# EAGLE design Audio_Cape_B1 (EAGLE 6.5.0)
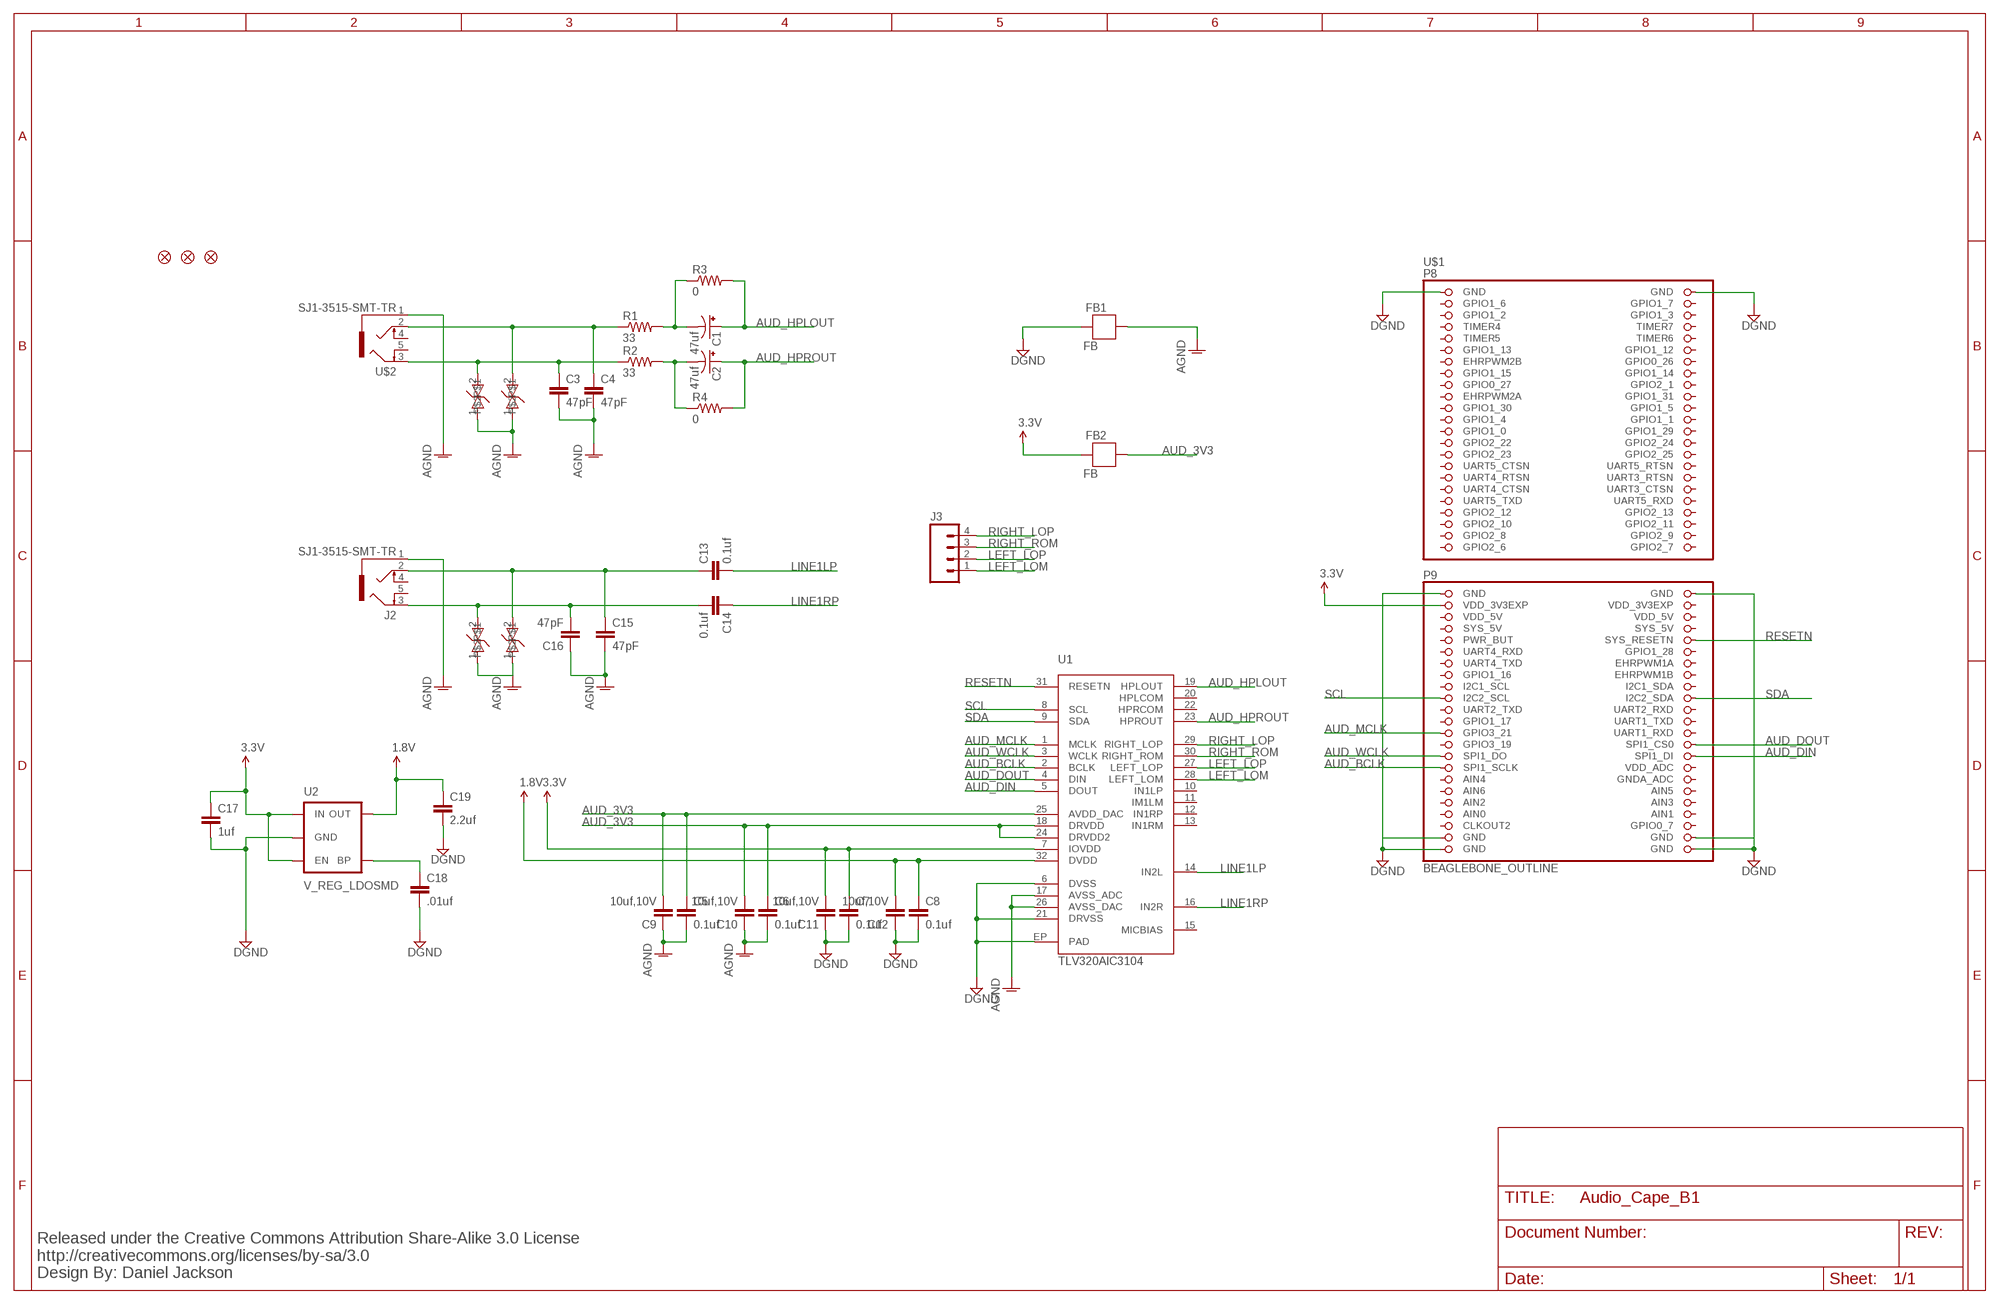
[diagram p0: schematic, sheet 1]

## Parts
C1  47uf  CAP_POL1206  [EIA3216]
C2  47uf  CAP_POL1206  [EIA3216]
C3  47pF  CAP0402-CAP  [0402-CAP]
C4  47pF  CAP0402-CAP  [0402-CAP]
C5  0.1uf  CAP0402-CAP  [0402-CAP]
C6  0.1uf  CAP0402-CAP  [0402-CAP]
C7  0.1uf  CAP0402-CAP  [0402-CAP]
C8  0.1uf  CAP0402-CAP  [0402-CAP]
C9  10uf,10V  CAP0603-CAP  [0603-CAP]
C10  10uf,10V  CAP0603-CAP  [0603-CAP]
C11  10uf,10V  CAP0603-CAP  [0603-CAP]
C12  10uf,10V  CAP0603-CAP  [0603-CAP]
C13  0.1uf  CAP0402-CAP  [0402-CAP]
C14  0.1uf  CAP0402-CAP  [0402-CAP]
C15  47pF  CAP0402-CAP  [0402-CAP]
C16  47pF  CAP0402-CAP  [0402-CAP]
C17  1uf  CAP0402-CAP  [0402-CAP]
C18  .01uf  CAP0402-CAP  [0402-CAP]
C19  2.2uf  CAP0402-CAP  [0402-CAP]
D1  PGB0010603MR  [0603]
D2  PGB0010603MR  [0603]
D3  PGB0010603MR  [0603]
D4  PGB0010603MR  [0603]
FB1  FB  [0603]
FB2  FB  [0603]
FID1  FIDUCIAL1X2.5  [FIDUCIAL-1X2.5]
FID2  FIDUCIAL1X2.5  [FIDUCIAL-1X2.5]
FID3  FIDUCIAL1X2.5  [FIDUCIAL-1X2.5]
J2  SJ1-3515-SMT-TR  [JACK-SMT]
J3  M04PTH  [1X04]
R1  33  RESISTOR0402-RES  [0402-RES]
R2  33  RESISTOR0402-RES  [0402-RES]
R3  0  RESISTOR0805-RES  [0805]
R4  0  RESISTOR0805-RES  [0805]
U1  TLV320AIC3104  [QFN-32]
U2  V_REG_LDOSMD  [SOT23-5]
U$1  BEAGLEBONE_OUTLINE  [BEAGLEBONE_SHIELD]
U$2  SJ1-3515-SMT-TR  [JACK-SMT]

## Nets
1.8V: C8.1 C12.2 C19.1 U1.32(DVDD) U2.5(OUT)
3.3V: C7.1 C11.2 C17.1 FB2.2 U1.7(IOVDD) U2.1(IN) U2.3(EN) U$1.49(VDD_3V3EXP)
AGND: C3.2 C4.2 C5.2 C6.2 C9.1 C10.1 C15.2 C16.1 D1.1 D2.1 D3.1 D4.1 FB1.1 J2.1 U1.17(AVSS_ADC) U1.26(AVSS_DAC) U$2.1
AUD_3V3: C5.1 C6.1 C9.2 C10.2 FB2.1 U1.18(DRVDD) U1.24(DRVDD2) U1.25(AVDD_DAC)
AUD_BCLK: U1.2(BCLK) U$1.77(SPI1_SCLK)
AUD_DIN: U1.5(DOUT) U$1.76(SPI1_DI)
AUD_DOUT: U1.4(DIN) U$1.74(SPI1_CS0)
AUD_HPLOUT: C1.A(+) R3.2 U1.19(HPLOUT)
AUD_HPROUT: C2.A(+) R4.2 U1.23(HPROUT)
AUD_MCLK: U1.1(MCLK) U$1.71(GPIO3_21)
AUD_WCLK: U1.3(WCLK) U$1.75(SPI1_DO)
DGND: C7.2 C8.2 C11.1 C12.1 C17.2 C18.2 C19.2 FB1.2 U1.6(DVSS) U1.21(DRVSS) U1.EP(PAD) U2.2(GND) U$1.1(GND) U$1.2(GND) U$1.47(GND) U$1.48(GND) U$1.89(GND) U$1.90(GND) U$1.91(GND) U$1.92(GND)
J1: C4.1 D2.2 R1.1 U$2.2
LEFT_LOM: J3.1 U1.28(LEFT_LOM)
LEFT_LOP: J3.2 U1.27(LEFT_LOP)
LINE1LP: C13.2 U1.14(IN2L)
LINE1RP: C14.1 U1.16(IN2R)
N$1: C14.2 C16.2 D3.2 J2.3
N$3: C1.C(-) R1.2 R3.1
N$4: C2.C(-) R2.2 R4.1
N$5: C3.1 D1.2 R2.1 U$2.3
N$6: C13.1 C15.1 D4.2 J2.2
N$7: C18.1 U2.4(BP)
RESETN: U1.31(RESETN) U$1.56(SYS_RESETN)
RIGHT_LOP: J3.4 U1.29(RIGHT_LOP)
RIGHT_ROM: J3.3 U1.30(RIGHT_ROM)
SCL: U1.8(SCL) U$1.65(I2C2_SCL)
SDA: U1.9(SDA) U$1.66(I2C2_SDA)
Unconnected: J2.4 J2.5 U1.10(IN1LP) U1.11(IM1LM) U1.12(IN1RP) U1.13(IN1RM) U1.15(MICBIAS) U1.20(HPLCOM) U1.22(HPRCOM) U$1.3(GPIO1_6) U$1.4(GPIO1_7) U$1.5(GPIO1_2) U$1.6(GPIO1_3) U$1.7(TIMER4) U$1.8(TIMER7) U$1.9(TIMER5) U$1.10(TIMER6) U$1.11(GPIO1_13) U$1.12(GPIO1_12) U$1.13(EHRPWM2B) U$1.14(GPIO0_26) U$1.15(GPIO1_15) U$1.16(GPIO1_14) U$1.17(GPIO0_27) U$1.18(GPIO2_1) U$1.19(EHRPWM2A) U$1.20(GPIO1_31) U$1.21(GPIO1_30) U$1.22(GPIO1_5) U$1.23(GPIO1_4) U$1.24(GPIO1_1) U$1.25(GPIO1_0) U$1.26(GPIO1_29) U$1.27(GPIO2_22) U$1.28(GPIO2_24) U$1.29(GPIO2_23) U$1.30(GPIO2_25) U$1.31(UART5_CTSN) U$1.32(UART5_RTSN) U$1.33(UART4_RTSN) U$1.34(UART3_RTSN) U$1.35(UART4_CTSN) U$1.36(UART3_CTSN) U$1.37(UART5_TXD) U$1.38(UART5_RXD) U$1.39(GPIO2_12) U$1.40(GPIO2_13) U$1.41(GPIO2_10) U$1.42(GPIO2_11) U$1.43(GPIO2_8) U$1.44(GPIO2_9) U$1.45(GPIO2_6) U$1.46(GPIO2_7) U$1.54(SYS_5V) U$1.55(PWR_BUT) U$1.57(UART4_RXD) U$1.58(GPIO1_28) U$1.59(UART4_TXD) U$1.60(EHRPWM1A) U$1.61(GPIO1_16) U$1.62(EHRPWM1B) U$1.63(I2C1_SCL) U$1.64(I2C1_SDA) U$1.67(UART2_TXD) U$1.68(UART2_RXD) U$1.69(GPIO1_17) U$1.70(UART1_TXD) U$1.72(UART1_RXD) U$1.73(GPIO3_19) U$1.78(VDD_ADC) U$1.79(AIN4) U$1.80(GNDA_ADC) U$1.81(AIN6) U$1.82(AIN5) U$1.83(AIN2) U$1.84(AIN3) U$1.86(AIN1) U$1.87(CLKOUT2) U$1.88(GPIO0_7) U$2.4 U$2.5

## Notes on the sheet
- Released under the Creative Commons Attribution Share-Alike 3.0 License
  http://creativecommons.org/licenses/by-sa/3.0
  Design By: Daniel Jackson

## Power pins joined to a net without a drawn wire
AIN0: U$1.85(AIN0)
SYS_5V: U$1.53(SYS_5V)
VDD_3V3EXP: U$1.50(VDD_3V3EXP)
VDD_5V: U$1.51(VDD_5V) U$1.52(VDD_5V)

## Library data of the parts
C1 C2 = SparkFun-Capacitors:CAP_POL: Capacitor Polarized These are standard SMD and PTH capacitors. Normally 10uF, 47uF, and 100uF in electrolytic and tantalum varieties. Always verify the external diameter of the through hole cap, it varies with capacity, voltage, and manufacturer. The EIA devices should be standard.; MANEX: 123-0001196
C3 C4 C15 C16 = SparkFun-Passives:CAP: Capacitor Standard 0603 ceramic capacitor, and 0.1" leaded capacitor.; MANEX: 123-0001115
C5-C8 = SparkFun-Passives:CAP: Capacitor Standard 0603 ceramic capacitor, and 0.1" leaded capacitor.; MANEX: 123-0001056
C9-C12 = SparkFun-Passives:CAP: Capacitor Standard 0603 ceramic capacitor, and 0.1" leaded capacitor.; MANEX: 123-0001127
C13 C14 C18 = SparkFun-Passives:CAP: Capacitor Standard 0603 ceramic capacitor, and 0.1" leaded capacitor.; MANEX: 123-0001032
C17 = SparkFun-Passives:CAP: Capacitor Standard 0603 ceramic capacitor, and 0.1" leaded capacitor.; MANEX: 123-0001087
C19 = SparkFun-Passives:CAP: Capacitor Standard 0603 ceramic capacitor, and 0.1" leaded capacitor.; MANEX: 123-0001094
D1-D4 = CircuitCo:PGB0010603MR; MANEX: 130-0001371
FB1 FB2 = SparkFun-Passives:FB; MANEX: 126-0001418
FID1-FID3 = SparkFun-Aesthetics:FIDUCIAL: Fiducial Alignment Points Various fiducial points for machine vision alignment.
J2 = audio-jack:SJ1-3515-SMT-TR; MANEX: 158-0003523
J3 = SparkFun-Connectors:M04: Header 4 Standard 4-pin 0.1" header. Use with straight break away headers (SKU : PRT-00116), right angle break away headers (PRT-00553), swiss pins (PRT-00743), machine pins (PRT-00117), and female headers (PRT-00115). Molex polarized connector foot print use with SKU : PRT-08231 with associated crimp pins and housings. 1MM SMD Version SKU: PRT-10208; MANEX: 258-0002845
R1 R2 = SparkFun-Passives:RESISTOR: Resistor Basic schematic elements and footprints for 0603, 1206, and PTH resistors.; MANEX: 110-0002014
R3 R4 = SparkFun-Passives:RESISTOR: Resistor Basic schematic elements and footprints for 0603, 1206, and PTH resistors.
U1 = CircuitCo:TLV320AIC3104; MANEX: 140-0004277
U2 = SparkFun-PowerIC:V_REG_LDO: Voltage Regulator LDO Standard 150mA LDO voltage regulator in SOT-23 layout. Micrel part MIC5205. BP (by-pass) pin is used to lower output noise with 470pF cap.; MANEX: 140-0001616
U$1 = adafruit:BEAGLEBONE_OUTLINE: Should match A3 pinout - but not completely tested
U$2 = audio-jack:SJ1-3515-SMT-TR; MANEX: 158-0003524

## Board
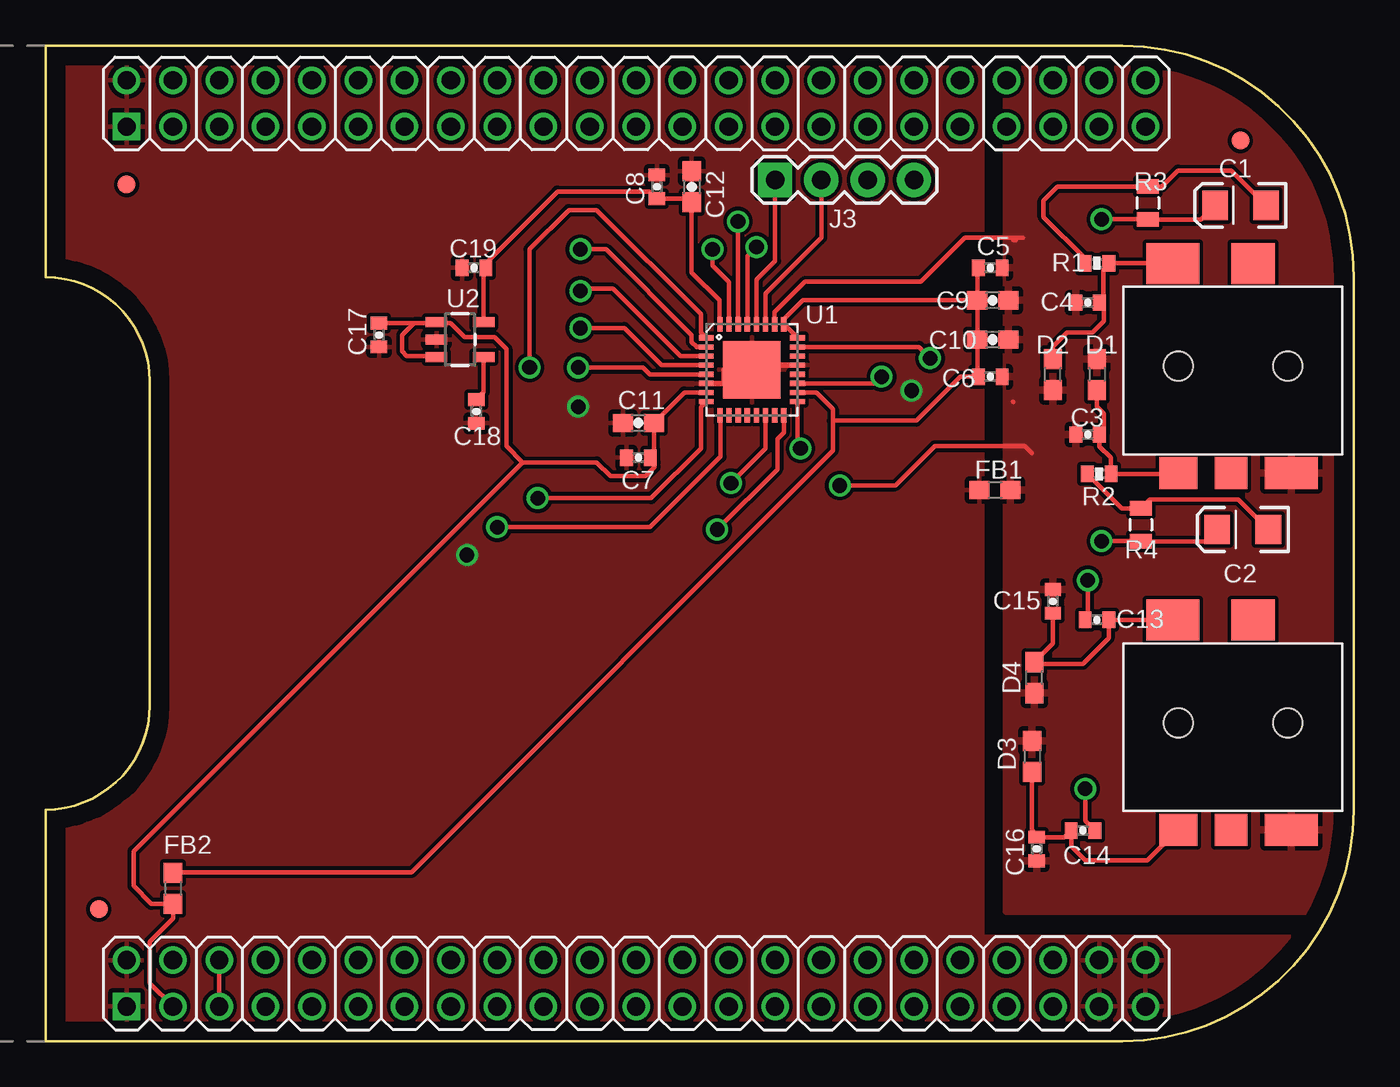
[diagram p1: board, top side]
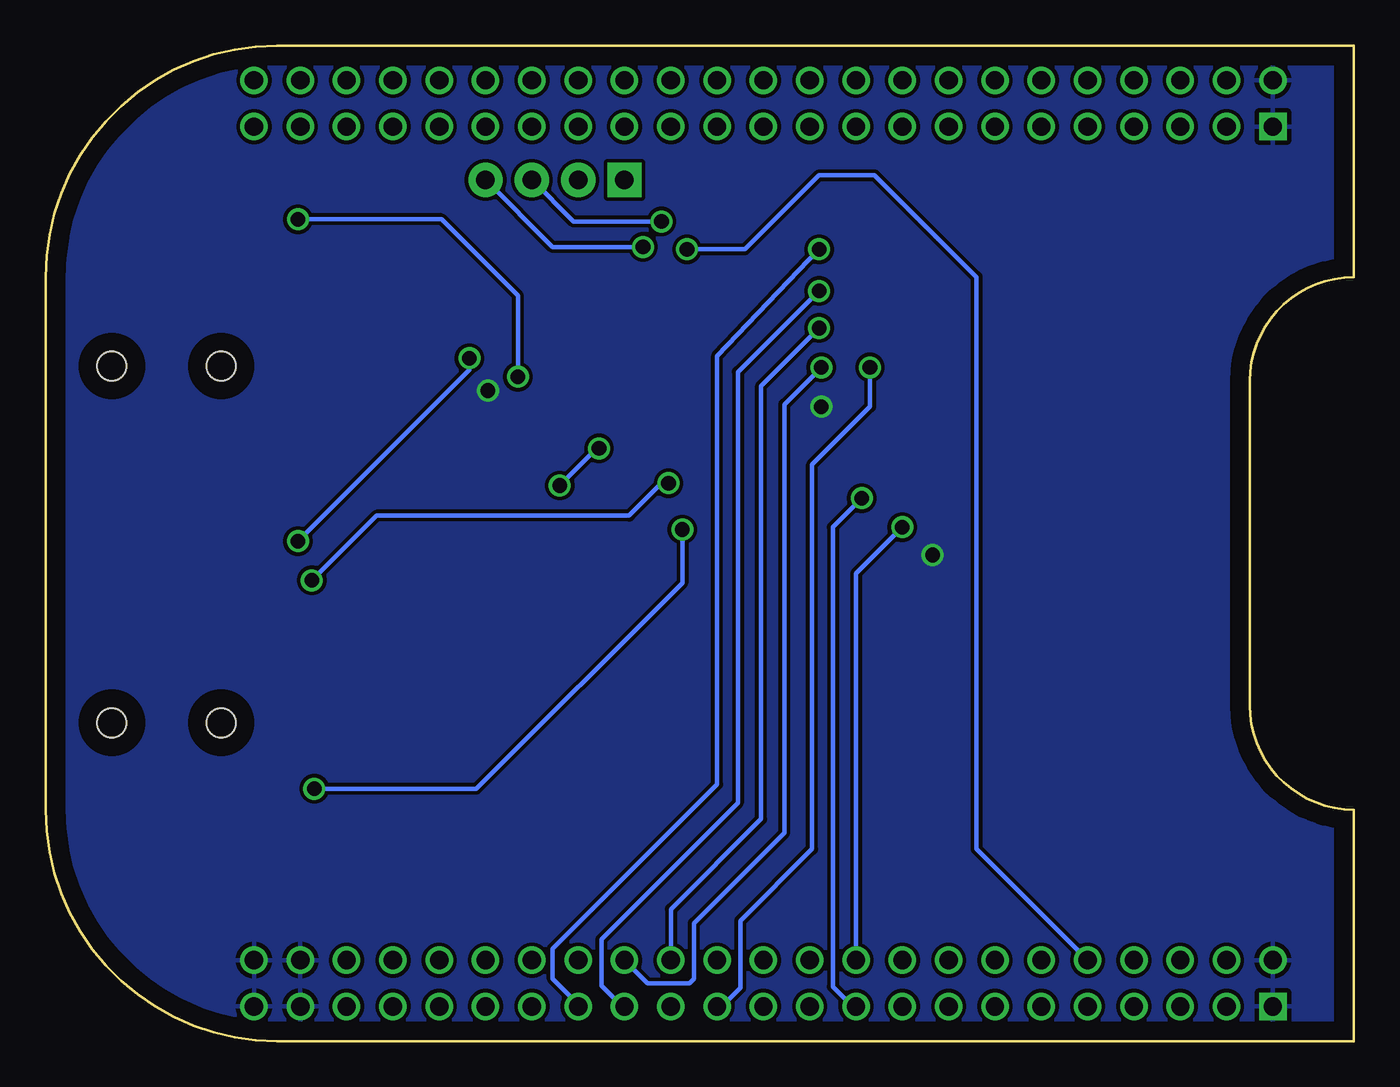
[diagram p2: board, bottom side, seen from below]

Size 71.75 x 54.61 mm. Coordinates in mm from the lower left corner, seen from the top.
Copper layers (1*16): Top 0.035mm / dielectric 1.5mm / Bottom 0.035mm
Design rules "default": minimum track width 10mil, minimum drill 24mil, track to track 8mil, track to pad 8mil, pad to pad 8mil, via to via 8mil, smd to smd 8mil, copper to edge 40mil, drill to drill 8mil, minimum pad ring 10mil, minimum via ring 8mil, stop-mask expansion 4mil, vias tented up to drill 0mil, thermal gap 10mil

### Footprints (pad centres in the part's own frame; a part is rotated, then mirrored left to right if it is on the bottom)
EIA3216 = smd 1.4 x 1.6: A 1.4,0; C -1.4,0
0402-CAP = smd 0.7 x 0.9: 1 -0.65,0; 2 0.65,0
0603-CAP = smd 1.1 x 1: 1 -0.85,0; 2 0.85,0
0603 = smd 1.1 x 1: 1 -0.85,0; 2 0.85,0
FIDUCIAL-1X2.5 = smd 1 x 1: 1 0,0
JACK-SMT = smd 2.9 x 1.75: 1 2.8,10.375 | smd 2.9 x 2.25: 2 9.3,-1.125 | smd 2.1 x 1.75: 3 9,10.375 | smd 2.4 x 2.25: 4 4.9,-1.125 | smd 1.8 x 1.75: 5 6.1,10.375 | hole 1.6: 3,4.5; 9,4.5
1X04 = drill 1.016 pad 1.88 square: 1 0,0 | drill 1.016 pad 1.88: 2 2.54,0; 3 5.08,0; 4 7.62,0
0402-RES = smd 0.7 x 0.9: 1 -0.65,0; 2 0.65,0
0805 = smd 0.8 x 1.2: 1 -0.9,0; 2 0.9,0
QFN-32 = smd 0.285 x 0.8: 1 -1.75,-2.5; 2 -1.25,-2.5; 3 -0.75,-2.5; 4 -0.25,-2.5; 5 0.25,-2.5; 6 0.75,-2.5; 7 1.25,-2.5; 8 1.75,-2.5; 17 1.75,2.5; 18 1.25,2.5; 19 0.75,2.5; 20 0.25,2.5; 21 -0.25,2.5; 22 -0.75,2.5; 23 -1.25,2.5; 24 -1.75,2.5 | smd 0.8 x 0.285: 9 2.5,-1.75; 10 2.5,-1.25; 11 2.5,-0.75; 12 2.5,-0.25; 13 2.5,0.25; 14 2.5,0.75; 15 2.5,1.25; 16 2.5,1.75; 25 -2.5,1.75; 26 -2.5,1.25; 27 -2.5,0.75; 28 -2.5,0.25; 29 -2.5,-0.25; 30 -2.5,-0.75; 31 -2.5,-1.25; 32 -2.5,-1.75 | smd 3.15 x 3.15: EP 0,0
SOT23-5 = smd 0.55 x 1.2: 1 -0.95,-1.3; 2 0,-1.3; 3 0.95,-1.3; 4 0.95,1.3; 5 -0.95,1.3
BEAGLEBONE_SHIELD = drill 1 square: 1 4.445,19.05; 47 52.705,19.05 | drill 1: 2 1.905,19.05; 3 4.445,21.59; 4 1.905,21.59; 5 4.445,24.13; 6 1.905,24.13; 7 4.445,26.67; 8 1.905,26.67; 9 4.445,29.21; 10 1.905,29.21; 11 4.445,31.75; 12 1.905,31.75; 13 4.445,34.29; 14 1.905,34.29; 15 4.445,36.83; 16 1.905,36.83; 17 4.445,39.37; 18 1.905,39.37; 19 4.445,41.91; 20 1.905,41.91; 21 4.445,44.45; 22 1.905,44.45; 23 4.445,46.99; 24 1.905,46.99; 25 4.445,49.53; 26 1.905,49.53; 27 4.445,52.07; 28 1.905,52.07; 29 4.445,54.61; 30 1.905,54.61; 31 4.445,57.15; 32 1.905,57.15; 33 4.445,59.69; 34 1.905,59.69; 35 4.445,62.23; 36 1.905,62.23; 37 4.445,64.77; 38 1.905,64.77; 39 4.445,67.31; 40 1.905,67.31; 41 4.445,69.85; 42 1.905,69.85; 43 4.445,72.39; 44 1.905,72.39; 45 4.445,74.93; 46 1.905,74.93; 48 50.165,19.05; 49 52.705,21.59; 50 50.165,21.59; 51 52.705,24.13; 52 50.165,24.13; 53 52.705,26.67; 54 50.165,26.67; 55 52.705,29.21; 56 50.165,29.21; 57 52.705,31.75; 58 50.165,31.75; 59 52.705,34.29; 60 50.165,34.29; 61 52.705,36.83; 62 50.165,36.83; 63 52.705,39.37; 64 50.165,39.37; 65 52.705,41.91; 66 50.165,41.91; 67 52.705,44.45; 68 50.165,44.45; 69 52.705,46.99; 70 50.165,46.99; 71 52.705,49.53; 72 50.165,49.53; 73 52.705,52.07; 74 50.165,52.07; 75 52.705,54.61; 76 50.165,54.61; 77 52.705,57.15; 78 50.165,57.15; 79 52.705,59.69; 80 50.165,59.69; 81 52.705,62.23; 82 50.165,62.23; 83 52.705,64.77; 84 50.165,64.77; 85 52.705,67.31; 86 50.165,67.31; 87 52.705,69.85; 88 50.165,69.85; 89 52.705,72.39; 90 50.165,72.39; 91 52.705,74.93; 92 50.165,74.93

### Placement (x,y rotation side)
C1  65.53,45.85 180 top
C2  65.66,28.07 180 top
C3  57.15,33.27 180 top
C4  57.15,40.51 180 top
C5  51.82,42.42 0 top
C6  51.82,36.45 0 top
C7  32.51,32 180 top
C8  33.53,46.86 90 top
C9  51.94,40.64 180 top
C10  51.94,38.48 180 top
C11  32.51,33.91 0 top
C12  35.43,46.86 270 top
C13  57.66,23.11 180 top
C14  56.9,11.56 180 top
C15  55.25,24.13 90 top
C16  54.36,10.54 90 top
C17  18.29,38.73 270 top
C18  23.62,34.54 270 top
C19  23.49,42.42 180 top
D1  57.66,36.58 270 top
D2  55.25,36.58 90 top
D3  54.1,15.62 270 top
D4  54.23,19.94 90 top
DRILEGEND  [DRILEGEND]  -15.62,-4.32 0 top  (outside the outline)
FB1  52.07,30.23 180 top
FB2  6.98,8.38 270 top
FID1  65.53,49.4 0 top
FID2  2.92,7.24 0 top
FID3  4.45,46.99 0 top
J2  71.12,21.97 180 top
J3  40.01,47.24 0 top
R1  57.66,42.67 180 top
R2  57.78,31.11 180 top
R3  60.45,45.97 270 top
R4  60.07,28.32 270 top
U1  38.73,36.83 270 top
U2  22.73,38.48 270 top
U$1  -14.61,54.61 270 top
U$2  71.12,41.53 180 top
U$4  [CIRCUITCO-LOGO]  17.4,19.81 0 top

### Tracks (layer width: path | path; a pad name or v marks a point on that pad's centre or on a via)
1.8V
  Top 0.254: U2.5 24.03,42.31 C19.1 24.15,42.69 28.07,46.61 33.13,46.61 C8.1 35.23,46.21 C12.2 35.43,42.16 36.96,40.64 36.96,39.36 U1.32
3.3V
  Top 0.254: FB2.2 6.98,7.11 | FB2.2 6.98,6.73 5.71,5.46 5.71,3.17 U$1.49 | FB2.2 5.8,7.53 4.83,8.51 4.83,10.41 26.16,31.75 | 26.16,31.75 30.23,31.75 30.99,30.99 32.89,30.99 33.4,31.5 33.4,31.76 C7.1 33.36,32.2 C11.2 35.03,35.58 U1.7 | C17.1 20.21,39.38 | 21.39,39.38 U2.1 | 21.39,39.38 22.21,39.38 22.99,38.61 24.64,38.61 25.27,37.97 25.27,32.64 26.16,31.75 | 21.39,39.38 20.21,39.38 | 20.21,39.38 19.56,38.73 19.56,37.85 19.81,37.59 21.37,37.59 U2.3
AGND  (via drill 0.8)
  Top 0.254: 53.06,35.08 53.09,35.05 | U1.26 39.98,39.98 41.66,41.66 48.01,41.66 50.42,44.07 53.21,44.07 | 53.59,44.07 53.21,44.07 | 53.21,44.07 53.09,43.94 53.21,43.94 | U1.17 41.23,32.68 v41.4,32.51 | v43.56,30.48 46.61,30.48 48.77,32.64 53.72,32.64 54.1,32.26
  Bottom 0.254: v41.4,32.51 41.53,32.51 v43.56,30.48
  pour Top: 52.7,54.61 52.7,7.11 71.75,7.11 71.75,54.61
AUD_3V3
  Top 0.254: C9.2 41.53,40.64 40.48,39.6 U1.25 U1.24 | C9.2 51.09,42.34 C5.1 | 50.99,38.58 C10.2 | C10.2 51.09,36.52 C6.1 50.17,36.45 47.75,34.04 43.18,34.04 | 43.18,34.04 43.18,32.38 20.07,9.27 7.02,9.27 FB2.1 | C9.2 C10.2 | U1.18 42.27,35.58 43.18,34.67 43.18,34.04
AUD_BCLK  (via drill 0.8)
  Top 0.254: v29.34,43.43 30.73,43.43 35.43,38.73 35.43,38.35 35.69,38.1 | 35.69,38.1 36.22,38.1 | U1.2 35.71,38.08 35.69,38.1
  Bottom 0.254: U$1.77 42.55,2.03 43.94,3.43 43.94,5.08 34.92,14.1 34.92,37.59 v29.34,43.43
AUD_DIN  (via drill 0.8)
  Top 0.254: v29.21,36.96 32.77,36.96 33.15,36.58 U1.5
  Bottom 0.254: U$1.76 38.73,3.17 36.45,3.17 36.2,3.43 36.2,6.48 31.24,11.43 31.24,34.92 v29.21,36.96
AUD_DOUT  (via drill 0.8)
  Top 0.254: v29.34,39.12 31.75,39.12 33.78,37.08 U1.4
  Bottom 0.254: 37.47,5.21 U$1.74 37.47,7.24 32.51,12.19 32.51,35.94 v29.34,39.12
AUD_HPLOUT  (via drill 0.8)
  Top 0.254: C1.A 63.36,45.07 R3.2 60.44,45.08 v57.91,45.08 | U1.19 45.48,36.08 v45.85,36.45
  Bottom 0.254: v45.85,36.45 45.85,40.89 50.04,45.08 v57.91,45.08
AUD_HPROUT  (via drill 0.8)
  Top 0.254: C2.A 64.26,27.42 R4.2 60.06,27.43 v57.91,27.43 | U1.23 47.9,38.08 v48.51,37.46
  Bottom 0.254: v48.51,37.46 48.51,36.83 v57.91,27.43
AUD_MCLK  (via drill 0.8)
  Top 0.254: v26.54,36.96 26.54,43.43 28.7,45.59 30.23,45.59 35.94,39.88 35.94,38.87 U1.1
  Bottom 0.254: U$1.71 34.67,1.9 33.66,2.92 33.66,6.6 29.72,10.54 29.72,31.62 26.54,34.8 v26.54,36.96
AUD_WCLK  (via drill 0.8)
  Top 0.254: v29.34,41.15 29.46,41.27 31.12,41.27 34.81,37.58 U1.3
  Bottom 0.254: U$1.75 40.13,1.9 41.27,3.05 41.27,5.59 33.78,13.08 33.78,36.7 v29.34,41.15
DGND  (via drill 0.8)
  Top 0.305: U1.6 36.23,36.07 37.21,36.07 37.21,36.83 U1.EP 40.13,36.83 40.13,37.08 41.4,37.08
  other vias: 47.5,35.69 23.11,26.67 29.21,34.8
  pour Top: -0.63,55.88 -0.63,0 51.44,0 51.44,55.88
  pour Bottom: 0,-0.13 71.75,-0.13 71.75,54.48 0,54.61
  pour Top: 51.31,5.71 70.1,5.71 70.1,-0.38 51.31,-0.38
J1
  Top 0.254: U$2.2 61.8,42.67 R1.1 58,42.36 58,40.71 C4.1 58.04,40.47 58.04,39.5 57.4,38.86 56.01,38.86 55.25,38.1 D2.2
LEFT_LOM
  Top 0.254: J3.1 40.01,42.8 38.98,41.78 U1.28
LEFT_LOP
  Top 0.254: J3.2 42.55,44.07 39.48,41.01 U1.27
LINE1LP  (via drill 0.8)
  Top 0.254: U1.14 39.48,32.5 v37.59,30.61 | v57.15,25.27 57.15,23.26 C13.2
  Bottom 0.254: v37.59,30.61 37.97,30.61 39.75,28.83 53.59,28.83 v57.15,25.27
LINE1RP  (via drill 0.8)
  Top 0.254: v57.02,13.84 57.02,12.08 C14.1 | U1.16 40.48,33.37 40.13,33.02 40.13,31.37 v36.83,28.07
  Bottom 0.254: v36.83,28.07 36.83,25.15 48.13,13.84 v57.02,13.84
N$1
  Top 0.254: 54.1,11.64 C16.2 | 56.08,11.39 C14.2 | C14.2 56.25,10.68 57.02,9.91 60.43,9.91 J2.3 | D3.2 54.1,11.44 C16.2 | C16.2 55.88,11.19 C14.2
N$3
  Top 0.254: R1.2 57.01,42.94 54.74,45.21 54.74,46.1 55.5,46.86 60.44,46.86 R3.1 61.22,46.87 62.1,47.75 65.03,47.75 C1.C
N$4
  Top 0.254: R2.2 59.03,29.22 R4.1 60.57,29.72 65.41,29.72 C2.C
N$5
  Top 0.254: U$2.3 62.08,31.11 R2.1 58.42,31.13 58.42,32 57.8,32.62 C3.1 58.04,33.31 58.04,34.42 57.66,34.8 D1.2
N$6
  Top 0.254: J2.2 61.8,23.11 C13.1 58.31,22.11 56.9,20.7 54.32,20.7 D4.2 55.25,21.8 C15.1
N$7
  Top 0.254: U2.4 24.03,35.6 C18.1
RESETN  (via drill 0.8)
  Top 0.254: v36.58,43.43 36.58,42.54 37.48,41.64 U1.31
  Bottom 0.254: v36.58,43.43 33.4,43.43 29.34,47.5 26.29,47.5 20.7,41.91 20.7,10.54 U$1.56
RIGHT_LOP  (via drill 0.8)
  Top 0.254: v38.99,43.56 38.48,43.06 U1.29
  Bottom 0.254: v38.99,43.56 43.94,43.56 J3.4
RIGHT_ROM  (via drill 0.8)
  Top 0.254: v37.97,44.96 37.98,44.95 U1.30
  Bottom 0.254: v37.97,44.96 42.8,44.96 J3.3
SCL  (via drill 0.8)
  Top 0.254: v26.99,29.78 33.21,29.78 35.94,32.51 35.94,34.79 U1.8
  Bottom 0.254: U$1.65 27.49,1.9 28.58,2.98 28.58,28.19 v26.99,29.78
SDA  (via drill 0.8)
  Top 0.254: v24.77,28.19 33.15,28.19 37.02,32.07 37.02,34.29 U1.9
  Bottom 0.254: U$1.66 27.3,25.65 v24.77,28.19
VDD_5V
  Top 0.254: U$1.52 U$1.51

### Text on the board
tDocu: AudioCape Rev. X1 | www.circuitco.com
DrillLegend: -ALL DIMENSIONS IN INCHES UNESS | OTHERWISE NOTED | - NO. LAYERS: 2 | - ARRAY: NO | - BOARD SIZE: 2.900000 x 2.200000 In. | - X-OUTS ALLOWED: YES | - SCORING: YES | - JUMP SCORING: NO | - TAB ROUT: NO | - MATERIAL: FR-4 | - FINAL THICKNESS: 0.062000 | - PLATING: Lead Free Solder | - OUTER CU WEIGHT: 1.000000 | - MASK SIDES: BOTH | - MASK COLOR: WHITE | - SILKSCREEN SIDES: FRONT | - SILKSCREEN COLOR: BLACK | - GOLD FINGERS: NO | - MIN TRACE/SPACE: 10 | - MIN HOLE SIZE: 31 | - NO. HOLES UNDER 12 MIL: 0 | - PLATED SLOTS: NO | - PLATED EDGES: NO | - RoHS COMPLIANT: YES | - ITAR COMPLIANT: NO | - CONFORM TO IPC-A-600, CLASS 2: NO | - CLASS 3: NO | - MILSPEC: NO | - ADD UL LOGO: NO | - ADD DATE CODE: NO | - ADD 94V-0 MARKINGS: NO | - COUNTERSINKS/BORES: NO | - CONTROLLED DIELECTRIC: NO | - CARBON INK: NO | - BLIND/BURRIED VIAS: NO | - VIA IN PAD: NO | - MASK PLUGGED VIAS: NO | - CONDUCTIVE FILLED VIAS: NO | - CONTROLLED IMPEDANCE: NO | LAYER-STACK
DrillLegend_01-16: 01-16
DrillLegend_01-20: 01-20